# EasyEDA schematic DRONE_PI_SENSOR_BOARD.json
TITLE: Sheet_1; REV: 1.0; Date: 2023-06-05; Sheet: 1/1; Drawn By: gunturi CM; Company: Your Company
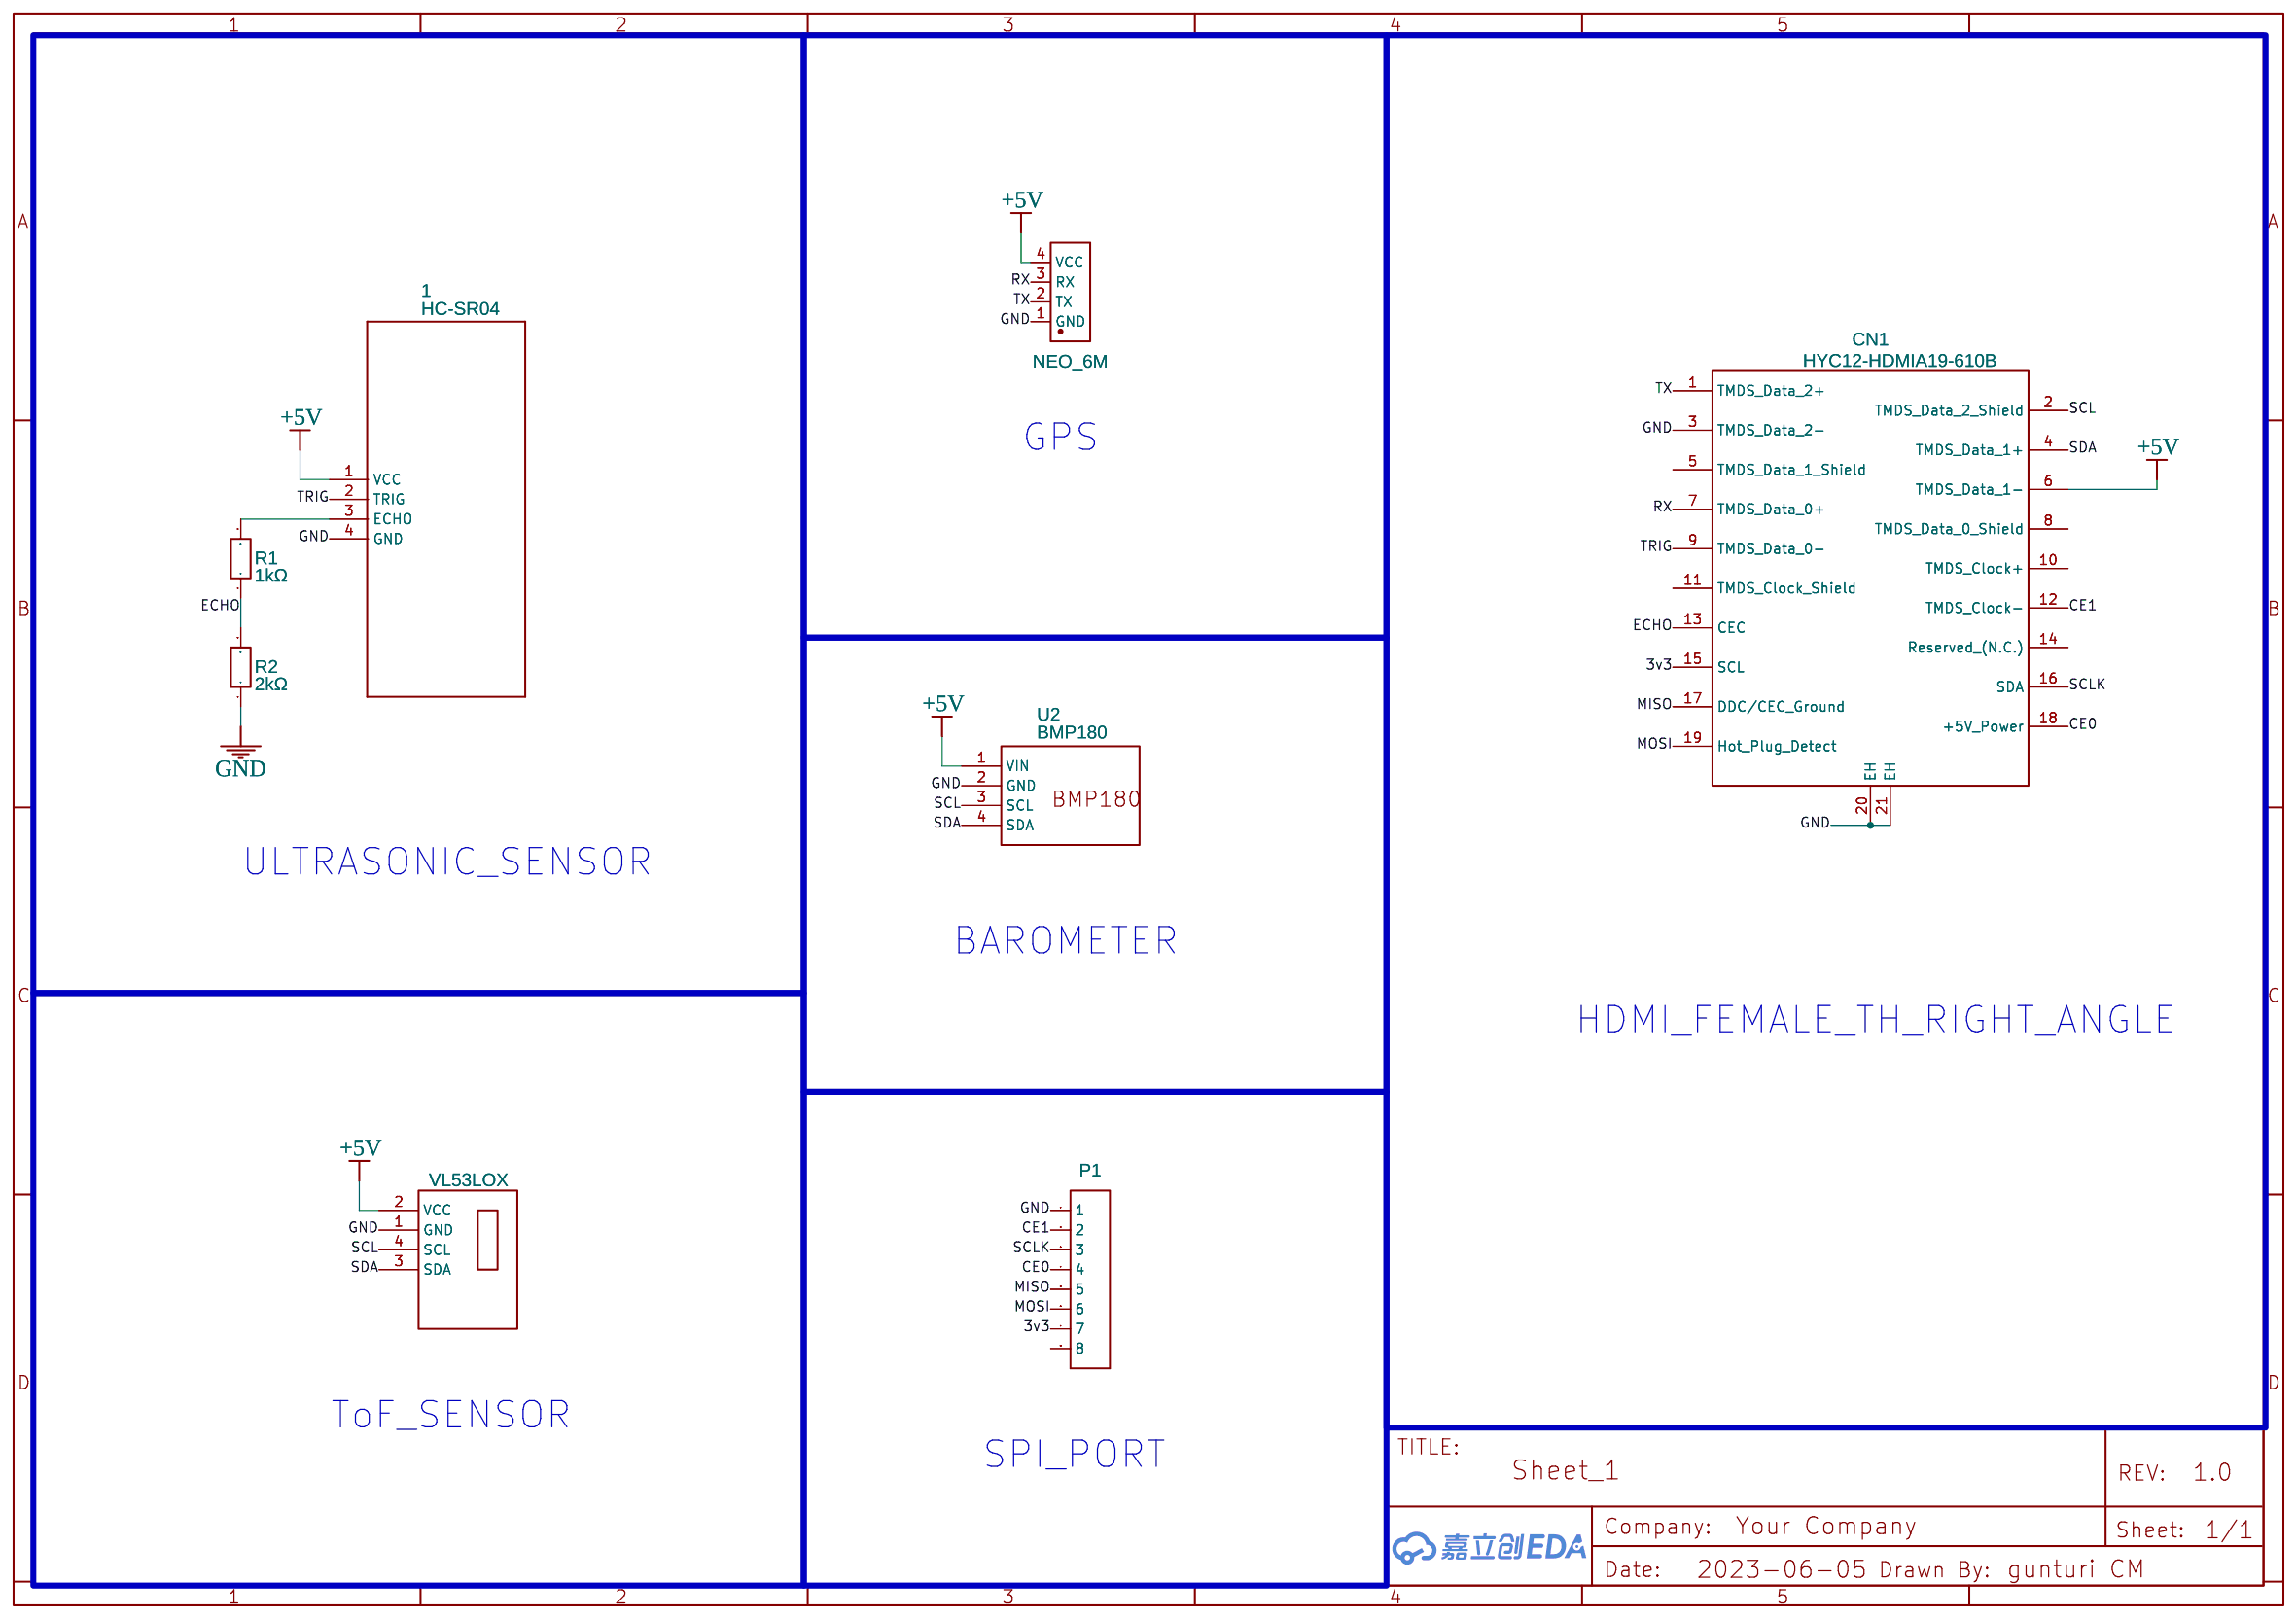
[diagram p0: schematic sheet]

## Parts
1  HC-SR04  [ULTRASONIC-HC-SR04]
CN1  HYC12-HDMIA19-610B  [HDMI-TH_HYC12-HDMIA19-61]
NEO_6M  XHB2.54-4P  [CONN-TH_4P-P2.54-XH2.54-LI-4P]
P1  HDR  [HDR-TH_8P-P2.54-V]
R1  1kΩ  [RES-TH_BD2.7-L6.2-P10.20-D0.4]
R2  2kΩ  [RES-TH_BD2.7-L6.2-P10.20-D0.4]
U2  BMP180  [BMP180]
VL53LOX  VL53LOX module SN  [CONNECTEUR GROVE I2C]

## Library data of the parts
1 = ULTRASONIC-HC-SR04 COPY: Contributor: gtanaka6
CN1 = HYC12-HDMIA19-610B: Supplier: LCSC; Supplier Part: C711354; Manufacturer: 华宇创; Contributor: LCSC; JLCPCB Part Class: Extended Part
NEO_6M = XHB2.54-4P: Supplier: LCSC; Supplier Part: C9900014704; Manufacturer: null; Contributor: lcsc; JLCPCB Part Class: Extended Part
P1 = TFT 1.8. HEADER-FEMALE CONNECTOR 8PIN: Supplier: LCSC; Manufacturer: BOOMELE; Manufacturer Part: Female headerHDR1X8-2.54; Supplier Part: C27438
R1 R2 = MO1/4W-220K±5%-ST52: Supplier: LCSC; Supplier Part: C2857428; Manufacturer: VO(翔胜); link: https://atta.szlcsc.com/upload/public/pdf/source/20200609/C600990_EE085E5D7E4C73997BF830687A2683BE.pdf; Contributor: lcsc; JLCPCB Part Class: Extended Part
U2 = BMP180: Contributor: delil1220
VL53LOX = VL53LOX module SN: Contributor: stentz

## Nets
3v3: CN1.15(SCL) P1.7
+5V: 1.1(VCC) CN1.6(TMDS Data 1-) NEO_6M.4(VCC) U2.1(VIN) VL53LOX.2(VCC)
GND: 1.4(GND) CN1.3(TMDS Data 2-) CN1.20(EH) CN1.21(EH) NEO_6M.1(GND) P1.1 R2.1 U2.2(GND) VL53LOX.1(GND)
CE0: CN1.18(+5V Power) P1.4
CE1: CN1.12(TMDS Clock-) P1.2
ECHO: CN1.13(CEC) R1.1 R2.2
MISO: CN1.17(DDC/CEC Ground) P1.5
MOSI: CN1.19(Hot Plug Detect) P1.6
RX: CN1.7(TMDS Data 0+) NEO_6M.3(RX)
SCL: CN1.2(TMDS Data 2 Shield) U2.3(SCL) VL53LOX.4(SCL)
SCLK: CN1.16(SDA) P1.3
SDA: CN1.4(TMDS Data 1+) U2.4(SDA) VL53LOX.3(SDA)
TRIG: 1.2(TRIG) CN1.9(TMDS Data 0-)
TX: CN1.1(TMDS Data 2+) NEO_6M.2(TX)
Net-(1-3): 1.3(ECHO) R1.2

Not connected (* = marked no-connect by the designer): CN1 5(TMDS Data 1 Shield) 8(TMDS Data 0 Shield) 10(TMDS Clock+) 11(TMDS Clock Shield) 14(Reserved (N.C.)); P1 8

## Notes on the sheet
- GPS
- ULTRASONIC_SENSOR
- BAROMETER
- HDMI_FEMALE_TH_RIGHT_ANGLE
- ToF_SENSOR
- SPI_PORT
